# EAGLE design tinyha_hat (EAGLE 7.7.0)
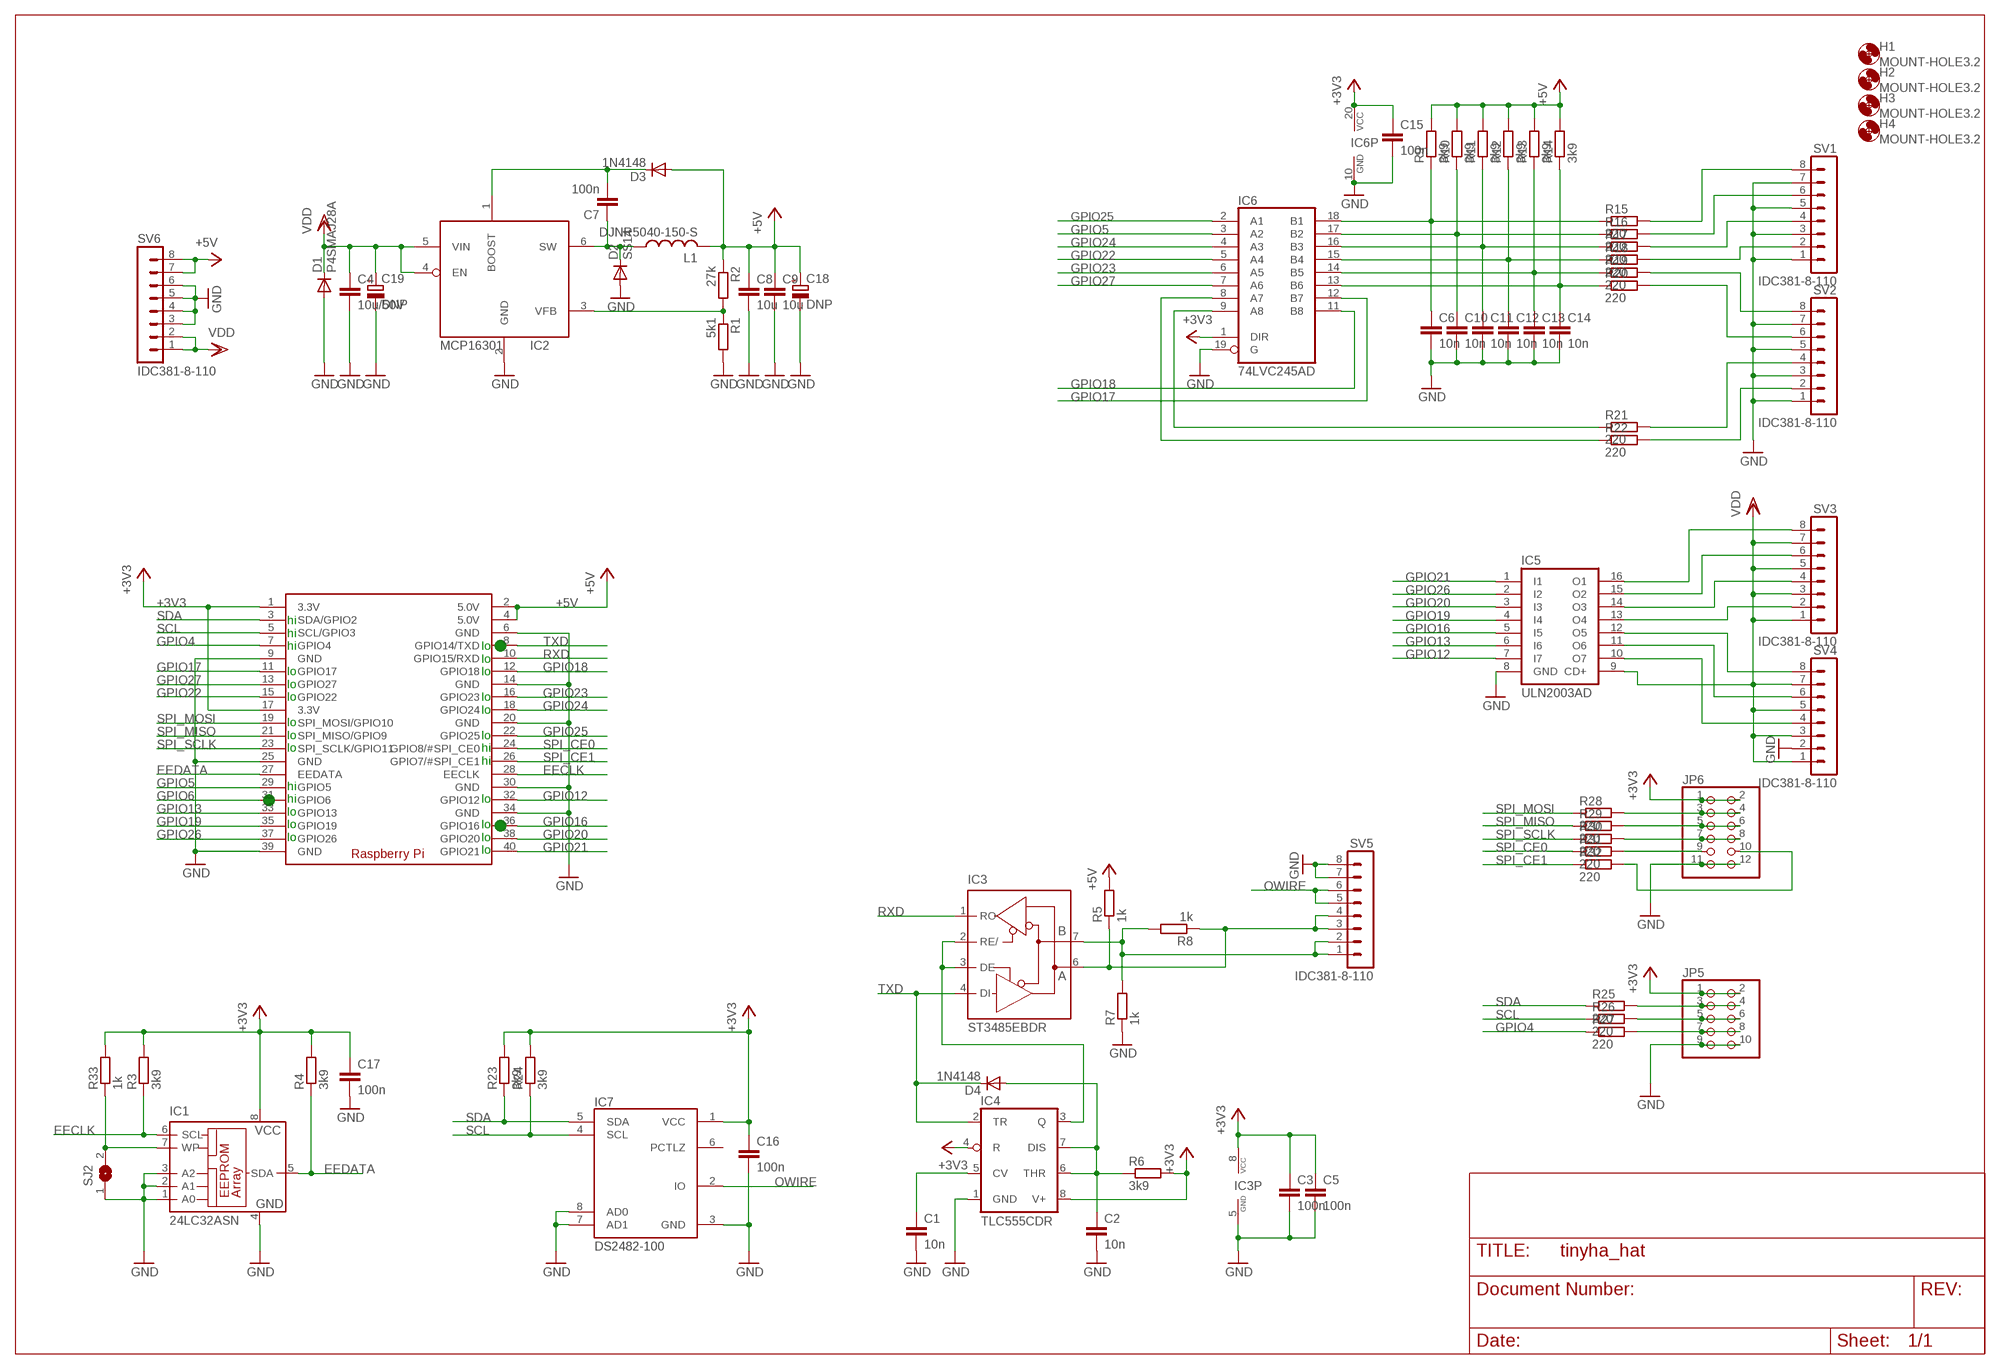
[diagram p0: schematic, sheet 1]

## Parts
C1  10n  C-EUC0603K  [C0603K]
C2  10n  C-EUC0603K  [C0603K]
C3  100n  C-EUC0603K  [C0603K]
C4  10u/50V  C-EUC1210K  [C1210K]
C5  100n  C-EUC0603K  [C0603K]
C6  10n  C-EUC0603K  [C0603K]
C7  100n  C-EUC0603K  [C0603K]
C8  10u  C-EUC0805K  [C0805K]
C9  10u  C-EUC0805K  [C0805K]
C10  10n  C-EUC0603K  [C0603K]
C11  10n  C-EUC0603K  [C0603K]
C12  10n  C-EUC0603K  [C0603K]
C13  10n  C-EUC0603K  [C0603K]
C14  10n  C-EUC0603K  [C0603K]
C15  100n  C-EUC0603K  [C0603K]
C16  100n  C-EUC0603K  [C0603K]
C17  100n  C-EUC0603K  [C0603K]
C18  DNP  CPOL-EUE3.5-8  [E3,5-8]
C19  DNP  CPOL-EUE5-10.5  [E5-10,5]
D1  P4SMAJ28A  DIODE-DO214AC  [DO214AC]
D2  SS14  DIODE-DO214AC  [DO214AC]
D3  1N4148  DIODE-MICROMELF-W  [MICROMELF-W]
D4  1N4148  DIODE-MICROMELF-W  [MICROMELF-W]
H1  MOUNT-HOLE3.2  [3,2]
H2  MOUNT-HOLE3.2  [3,2]
H3  MOUNT-HOLE3.2  [3,2]
H4  MOUNT-HOLE3.2  [3,2]
IC1  24LC32ASN  [SO-08]
IC2  MCP16301  [SOT23-6L]
IC3  ST3485EBDR  MAX481CSA  [SO08]
IC4  TLC555CDR  LM555D  [SO08]
IC5  ULN2003AD  [SO16]
IC6  74LVC245AD  74HC245DW  [SO20W]
IC7  DS2482-100  [SOIC-8]
JP5  PINHD-2X5  [2X05]
JP6  PINHD-2X6  [2X06]
L1  DJNR5040-150-S  DJNR5040  [DJNR5040]
R1  5k1  R-EU_R0603  [R0603]
R2  27k  R-EU_R0603  [R0603]
R3  3k9  R-EU_R0603  [R0603]
R4  3k9  R-EU_R0603  [R0603]
R5  1k  R-EU_R0603  [R0603]
R6  3k9  R-EU_R0603  [R0603]
R7  1k  R-EU_R0603  [R0603]
R8  1k  R-EU_R0603  [R0603]
R9  3k9  R-EU_R0603  [R0603]
R10  3k9  R-EU_R0603  [R0603]
R11  3k9  R-EU_R0603  [R0603]
R12  3k9  R-EU_R0603  [R0603]
R13  3k9  R-EU_R0603  [R0603]
R14  3k9  R-EU_R0603  [R0603]
R15  220  R-EU_R0603  [R0603]
R16  220  R-EU_R0603  [R0603]
R17  220  R-EU_R0603  [R0603]
R18  220  R-EU_R0603  [R0603]
R19  220  R-EU_R0603  [R0603]
R20  220  R-EU_R0603  [R0603]
R21  220  R-EU_R0603  [R0603]
R22  220  R-EU_R0603  [R0603]
R23  3k9  R-EU_R0603  [R0603]
R24  3k9  R-EU_R0603  [R0603]
R25  220  R-EU_R0603  [R0603]
R26  220  R-EU_R0603  [R0603]
R27  220  R-EU_R0603  [R0603]
R28  220  R-EU_R0603  [R0603]
R29  220  R-EU_R0603  [R0603]
R30  220  R-EU_R0603  [R0603]
R31  220  R-EU_R0603  [R0603]
R32  220  R-EU_R0603  [R0603]
R33  1k  R-EU_R0603  [R0603]
RPI1  RASPBERRYPI_BPLUS_ZERO  [PI_HAT_ZERO]
SJ2  SJ  [SJ]
SV1  IDC381-8-110  MA08-1-IDC  [IDC381-8]
SV2  IDC381-8-110  MA08-1-IDC  [IDC381-8]
SV3  IDC381-8-110  MA08-1-IDC  [IDC381-8]
SV4  IDC381-8-110  MA08-1-IDC  [IDC381-8]
SV5  IDC381-8-110  MA08-1-IDC  [IDC381-8]
SV6  IDC381-8-110  MA08-1-IDC  [IDC381-8]

## Nets
+3V3: C3.1 C5.1 C15.1 C16.1 C17.1 IC1.8(VCC) IC3.8(VCC) IC4.4(R) IC4.8(V+) IC6.1(DIR) IC6.20(VCC) IC7.1(VCC) JP5.1 JP5.2 JP6.1 JP6.2 R3.2 R4.2 R6.2 R23.2 R24.2 R33.2 RPI1.1(3.3V) RPI1.17(3.3V)
+5V: C8.1 C9.1 C18.+ D3.A L1.2 R2.1 R5.2 R9.2 R10.2 R11.2 R12.2 R13.2 R14.2 RPI1.2(5.0V) RPI1.4(5.0V) SV6.7 SV6.8
EECLK: IC1.6(SCL) R3.1 RPI1.28(EECLK)
EEDATA: IC1.5(SDA) R4.1 RPI1.27(EEDATA)
GND: C1.2 C2.2 C3.2 C4.2 C5.2 C6.2 C8.2 C9.2 C10.2 C11.2 C12.2 C13.2 C14.2 C15.2 C16.2 C17.2 C18.- C19.- D1.A D2.A IC1.1(A0) IC1.2(A1) IC1.3(A2) IC1.4(GND) IC2.2(GND) IC3.5(GND) IC4.1(GND) IC5.8(GND) IC6.10(GND) IC6.19(G) IC7.3(GND) IC7.7(AD1) IC7.8(AD0) JP5.9 JP5.10 JP6.11 JP6.12 R1.2 R7.1 RPI1.6(GND) RPI1.9(GND) RPI1.14(GND) RPI1.20(GND) RPI1.25(GND) RPI1.30(GND) RPI1.34(GND) RPI1.39(GND) SJ2.1 SV1.1 SV1.3 SV1.5 SV1.7 SV2.1 SV2.3 SV2.5 SV2.7 SV4.2 SV5.7 SV5.8 SV6.3 SV6.4 SV6.5 SV6.6
GPIO4: R27.1 RPI1.7(GPIO4)
GPIO5: IC6.3(A2) RPI1.29(GPIO5)
GPIO6: RPI1.31(GPIO6)
GPIO12: IC5.7(I7) RPI1.32(GPIO12)
GPIO13: IC5.6(I6) RPI1.33(GPIO13)
GPIO16: IC5.5(I5) RPI1.36(GPIO16)
GPIO17: IC6.12(B7) RPI1.11(GPIO17)
GPIO18: IC6.11(B8) RPI1.12(GPIO18)
GPIO19: IC5.4(I4) RPI1.35(GPIO19)
GPIO20: IC5.3(I3) RPI1.38(GPIO20)
GPIO21: IC5.1(I1) RPI1.40(GPIO21)
GPIO22: IC6.5(A4) RPI1.15(GPIO22)
GPIO23: IC6.6(A5) RPI1.16(GPIO23)
GPIO24: IC6.4(A3) RPI1.18(GPIO24)
GPIO25: IC6.2(A1) RPI1.22(GPIO25)
GPIO26: IC5.2(I2) RPI1.37(GPIO26)
GPIO27: IC6.7(A6) RPI1.13(GPIO27)
N$1: C1.1 IC4.5(CV)
N$2: IC5.16(O1) SV3.8
N$3: IC3.2(RE/) IC3.3(DE) IC4.3(Q)
N$4: C2.1 D4.A IC4.6(THR) IC4.7(DIS) R6.1
N$5: IC5.15(O2) SV3.6
N$6: IC5.14(O3) SV3.4
N$7: IC5.13(O4) SV3.2
N$8: IC5.12(O5) SV4.8
N$9: IC5.11(O6) SV4.6
N$10: IC3.7(B) R7.2 R8.2 SV5.1 SV5.2
N$11: IC5.10(O7) SV4.4
N$12: C6.1 IC6.18(B1) R9.1 R15.1
N$13: C10.1 IC6.17(B2) R10.1 R16.1
N$14: IC2.3(VFB) R1.1 R2.2
N$15: C11.1 IC6.16(B3) R11.1 R17.1
N$16: C12.1 IC6.15(B4) R12.1 R18.1
N$17: C13.1 IC6.14(B5) R13.1 R19.1
N$18: C14.1 IC6.13(B6) R14.1 R20.1
N$19: R15.2 SV1.8
N$20: C7.1 D2.C IC2.6(SW) L1.1
N$21: R16.2 SV1.6
N$22: C7.2 D3.C IC2.1(BOOST)
N$24: R17.2 SV1.4
N$25: R18.2 SV1.2
N$26: R19.2 SV2.8
N$27: R20.2 SV2.6
N$28: JP6.3 JP6.4 R28.2
N$29: JP6.5 JP6.6 R29.2
N$30: IC6.9(A8) R21.1
N$31: IC6.8(A7) R22.1
N$32: R21.2 SV2.4
N$33: R22.2 SV2.2
N$34: JP6.7 JP6.8 R30.2
N$35: JP6.9 R31.2
N$36: JP6.10 R32.2
N$37: JP5.3 JP5.4 R25.2
N$38: JP5.5 JP5.6 R26.2
N$39: JP5.7 JP5.8 R27.2
N$40: IC1.7(WP) R33.1 SJ2.2
N$42: IC3.6(A) R5.1 R8.1 SV5.3 SV5.4
OWIRE: IC7.2(IO) SV5.5 SV5.6
RXD: IC3.1(RO) RPI1.10(GPIO15/RXD)
SCL: IC7.4(SCL) R24.1 R26.1 RPI1.5(SCL/GPIO3)
SDA: IC7.5(SDA) R23.1 R25.1 RPI1.3(SDA/GPIO2)
SPI_CE0: R31.1 RPI1.24(GPIO8/#SPI_CE0)
SPI_CE1: R32.1 RPI1.26(GPIO7/#SPI_CE1)
SPI_MISO: R29.1 RPI1.21(SPI_MISO/GPIO9)
SPI_MOSI: R28.1 RPI1.19(SPI_MOSI/GPIO10)
SPI_SCLK: R30.1 RPI1.23(SPI_SCLK/GPIO11)
TXD: D4.C IC3.4(DI) IC4.2(TR) RPI1.8(GPIO14/TXD)
VDD: C4.1 C19.+ D1.C IC2.4(EN) IC2.5(VIN) IC5.9(CD+) SV3.1 SV3.3 SV3.5 SV3.7 SV4.1 SV4.3 SV4.5 SV4.7 SV6.1 SV6.2
Unconnected: IC7.6(PCTLZ)

## Notes on the sheet
- hi
  hi
  hi
  
  lo
  lo
  lo
  
  lo
  lo
  lo
  
  
  hi
  hi
  lo
  lo
  lo
- lo
  lo
  lo
  
  lo
  lo
  
  lo
  hi
  hi
  
  
  lo
  
  lo
  lo
  lo

## Library data of the parts
C1-C17 = rcl:C-EU: CAPACITOR, European symbol
C18 C19 = rcl:CPOL-EU: POLARIZED CAPACITOR, European symbol
D1-D4 = diode:DIODE-: DIODE
H1-H4 = holes:MOUNT-HOLE: MOUNTING HOLE with drill center marker
IC1 = microchip:24*: Serial EEPROM I2C; MF: MICROCHIP; MPN: 24LC32A/SN; OC_FARNELL: 9758003; OC_NEWARK: 33C2976
IC2 = custom:MCP16301
IC3 = maxim:MAX481CSA: RS485 TRANSEIVER; MF: MAXIM; MPN: MAX481CSA; OC_FARNELL: unknown; OC_NEWARK: 90C3817
IC4 = linear:*555: TIMER
IC5 = uln-udn:ULN2003A: DRIVER ARRAY
IC6 = 74xx-eu:74*245: Octal BUS TRANSCEIVER, 3-state
IC7 = dallas-1:DS2482-100
JP5 = pinhead:PINHD-2X5: PIN HEADER
JP6 = pinhead:PINHD-2X6: PIN HEADER
L1 = custom:DJNR5040
R1-R33 = rcl:R-EU_: RESISTOR, European symbol
RPI1 = microbuilder:RASPBERRYPI_BPLUS
SJ2 = jumper:SJ: SMD solder JUMPER
SV1-SV6 = custom:MA08-1: PIN HEADER

## Board
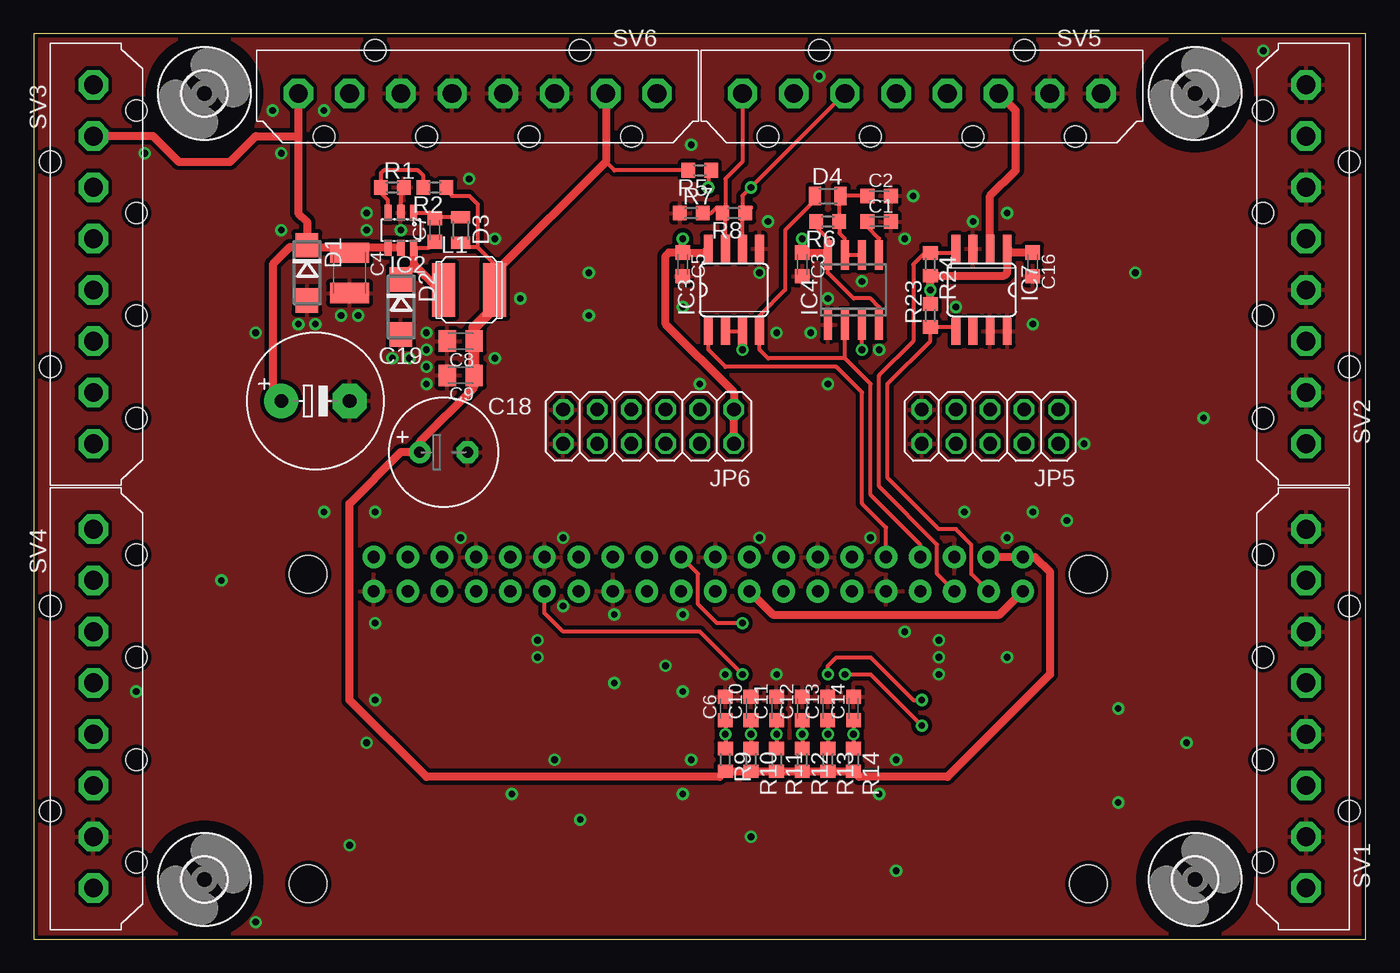
[diagram p1: board, top side]
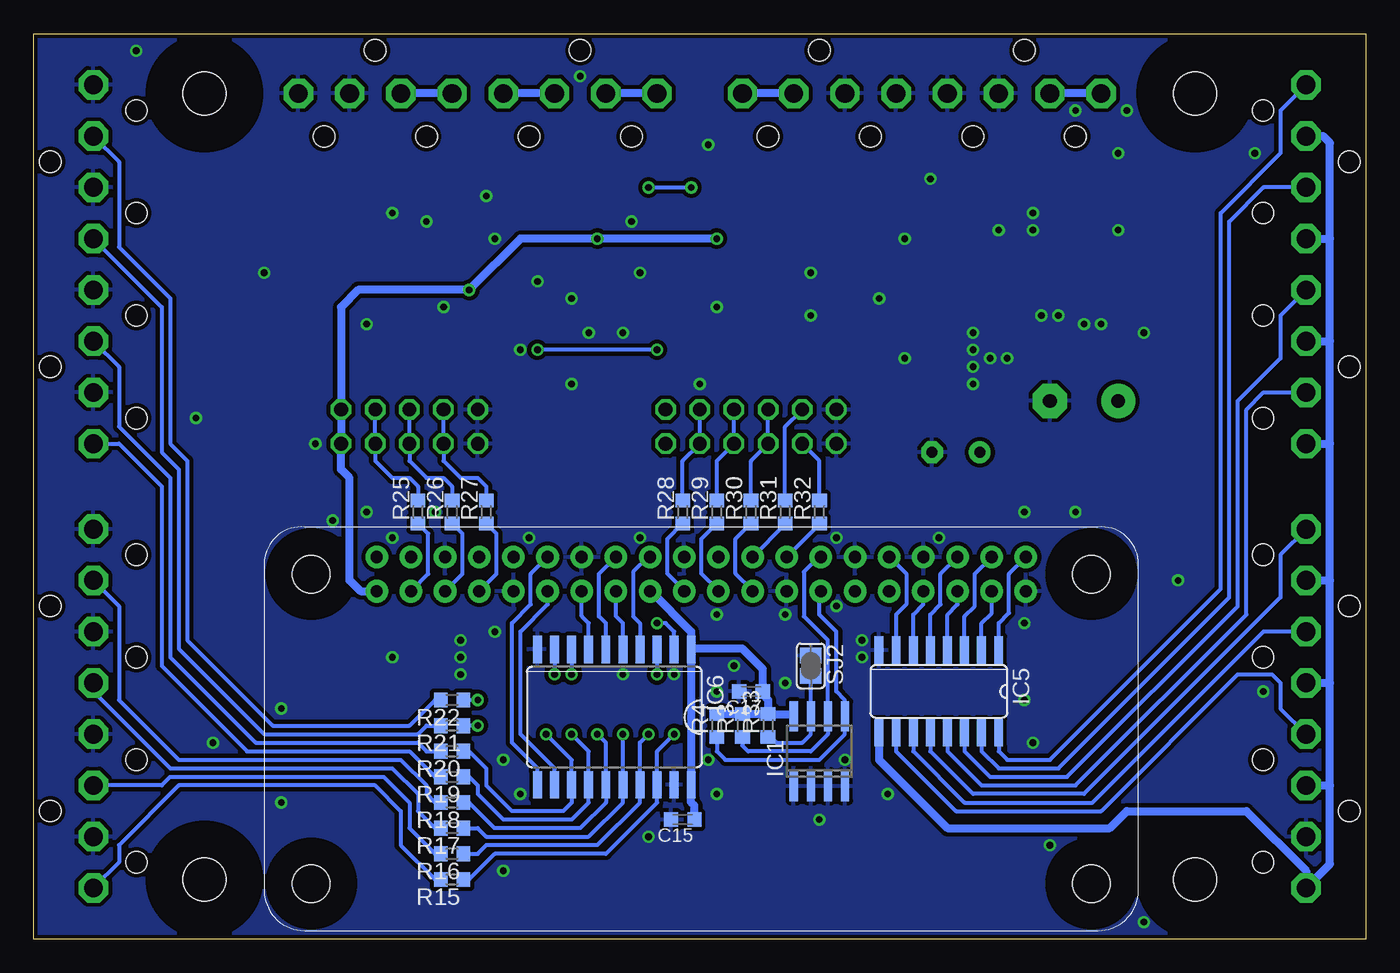
[diagram p2: board, bottom side, seen from below]

Size 99.06 x 67.31 mm. Coordinates in mm from the lower left corner, seen from the top.
Outline: 0,0 99.06,0 99.06,67.31 0,67.31 0,0
Copper layers (1*16): Top 0.035mm / dielectric 1.5mm / Bottom 0.035mm
Design rules "adafruit *": minimum track width 8mil, minimum drill 15.5mil, track to track 8mil, track to pad 8mil, pad to pad 8mil, via to via 8mil, smd to smd 0mil, copper to edge 10mil, drill to drill 8mil, minimum pad ring 10mil, minimum via ring 8mil, stop-mask expansion 2mil, vias tented up to drill 20mil, thermal gap 12mil

### Footprints (pad centres in the part's own frame; a part is rotated, then mirrored left to right if it is on the bottom)
C0603K = smd 1.05 x 1.08: 1 -0.875,0; 2 0.875,0
C1210K = smd 1.5 x 2.9: 1 -1.5,0; 2 1.5,0
C0805K = smd 1.3 x 1.6: 1 -1,0; 2 1,0
E3,5-8 = drill 0.813 pad 1.6: + -1.778,0 | drill 0.813 pad 1.6 octagon: - 1.778,0
E5-10,5 = drill 1.016 pad 2.54: + -2.54,0 | drill 1.016 pad 2.54 octagon: - 2.54,0
DO214AC = smd 1.8 x 1.7: A 2.05,0; C -2.05,0
MICROMELF-W = smd 0.9 x 1.4: A 0.95,0; C -0.95,0
3,2 = hole 3.2: 0,0
SO-08 = smd 0.6 x 2.2: 1 -1.905,-2.6; 2 -0.635,-2.6; 3 0.635,-2.6; 4 1.905,-2.6; 5 1.905,2.6; 6 0.635,2.6; 7 -0.635,2.6; 8 -1.905,2.6
SOT23-6L = smd 0.55 x 1.2: 1 -0.95,-1.3; 2 0,-1.3; 3 0.95,-1.3; 4 0.95,1.3; 5 0,1.3; 6 -0.95,1.3
SO08 = smd 0.66 x 2.032: 1 -1.905,-3.073; 2 -0.635,-3.073; 3 0.635,-3.073; 4 1.905,-3.073; 5 1.905,3.073; 6 0.635,3.073; 7 -0.635,3.073; 8 -1.905,3.073
SO08' = smd 0.6 x 2.2: 1 -1.905,-2.6; 2 -0.635,-2.6; 3 0.635,-2.6; 4 1.905,-2.6; 5 1.905,2.6; 6 0.635,2.6; 7 -0.635,2.6; 8 -1.905,2.6
SO16 = smd 0.66 x 2.032: 1 -4.445,-3.073; 2 -3.175,-3.073; 3 -1.905,-3.073; 4 -0.635,-3.073; 5 0.635,-3.073; 6 1.905,-3.073; 7 3.175,-3.073; 8 4.445,-3.073; 9 4.445,3.073; 10 3.175,3.073; 11 1.905,3.073; 12 0.635,3.073; 13 -0.635,3.073; 14 -1.905,3.073; 15 -3.175,3.073; 16 -4.445,3.073
SO20W = smd 0.66 x 2.032: 1 -5.715,-5.029; 2 -4.445,-5.029; 3 -3.175,-5.029; 4 -1.905,-5.029; 5 -0.635,-5.029; 6 0.635,-5.029; 7 1.905,-5.029; 8 3.175,-5.029; 9 4.445,-5.029; 10 5.715,-5.029; 11 5.715,5.029; 12 4.445,5.029; 13 3.175,5.029; 14 1.905,5.029; 15 0.635,5.029; 16 -0.635,5.029; 17 -1.905,5.029; 18 -3.175,5.029; 19 -4.445,5.029; 20 -5.715,5.029
SOIC-8 = smd 2.032 x 0.66: 1 -3.073,1.27; 2 -3.073,0; 3 -3.073,-1.27; 4 -3.073,-2.54; 5 3.073,-2.54; 6 3.073,-1.27; 7 3.073,0; 8 3.073,1.27
2X05 = drill 1.016 octagon: 1 -5.08,-1.27; 2 -5.08,1.27; 3 -2.54,-1.27; 4 -2.54,1.27; 5 0,-1.27; 6 0,1.27; 7 2.54,-1.27; 8 2.54,1.27; 9 5.08,-1.27; 10 5.08,1.27
2X06 = drill 1.016 octagon: 1 -6.35,-1.27; 2 -6.35,1.27; 3 -3.81,-1.27; 4 -3.81,1.27; 5 -1.27,-1.27; 6 -1.27,1.27; 7 1.27,-1.27; 8 1.27,1.27; 9 3.81,-1.27; 10 3.81,1.27; 11 6.35,-1.27; 12 6.35,1.27
DJNR5040 = smd 1.7 x 4: 1 -1.9,0; 2 1.9,0
R0603 = smd 1 x 1.1: 1 -0.85,0; 2 0.85,0
PI_HAT_ZERO = drill 0.9 pad 1.676: 1 8.37,25.23; 2 8.37,27.77; 3 10.91,25.23; 4 10.91,27.77; 5 13.45,25.23; 6 13.45,27.77; 7 15.99,25.23; 8 15.99,27.77; 9 18.53,25.23; 10 18.53,27.77; 11 21.07,25.23; 12 21.07,27.77; 13 23.61,25.23; 14 23.61,27.77; 15 26.15,25.23; 16 26.15,27.77; 17 28.69,25.23; 18 28.69,27.77; 19 31.23,25.23; 20 31.23,27.77; 21 33.77,25.23; 22 33.77,27.77; 23 36.31,25.23; 24 36.31,27.77; 25 38.85,25.23; 26 38.85,27.77; 27 41.39,25.23; 28 41.39,27.77; 29 43.93,25.23; 30 43.93,27.77; 31 46.47,25.23; 32 46.47,27.77; 33 49.01,25.23; 34 49.01,27.77; 35 51.55,25.23; 36 51.55,27.77; 37 54.09,25.23; 38 54.09,27.77; 39 56.63,25.23; 40 56.63,27.77 | hole 2.8: 3.5,3.5; 3.5,26.5; 61.5,26.5; 61.5,3.5
SJ = smd 1.168 x 1.6: 1 -0.762,0; 2 0.762,0
IDC381-8 = drill 1.4 pad 2.184 octagon: 1 -13.335,0; 2 -9.525,0; 3 -5.715,0; 4 -1.905,0; 5 1.905,0; 6 5.715,0; 7 9.525,0; 8 13.335,0 | hole 1.6: -11.43,-3.2; -3.81,-3.2; 3.81,-3.2; 11.43,-3.2; -7.62,3.2; 7.62,3.2

### Placement (x,y rotation side)
C1  62.87,53.34 0 top
C2  62.87,55.24 0 top
C3  57.15,50.16 270 top
C4  23.5,49.53 270 top
C5  48.26,50.16 270 top
C6  51.44,17.14 90 top
C7  29.84,52.7 90 top
C8  31.75,44.45 180 top
C9  31.75,41.91 180 top
C10  53.34,17.14 90 top
C11  55.24,17.14 90 top
C12  57.15,17.14 90 top
C13  59.05,17.14 90 top
C14  60.96,17.14 90 top
C15  50.8,8.89 180 bottom
C16  74.3,50.16 270 top
C17  45.72,18.41 180 bottom
C18  30.48,36.2 0 top
C19  20.95,40.01 0 top
D1  20.32,49.53 270 top
D2  27.3,46.99 270 top
D3  31.75,52.7 270 top
D4  59.05,55.24 0 top
H1  12.7,4.45 0 top
H2  86.36,4.45 0 top
H3  12.7,62.87 0 top
H4  86.36,62.87 0 top
IC1  40.64,13.97 0 bottom
IC2  27.3,52.7 180 top
IC3  52.07,48.26 0 top
IC4  TLC555CDR  [SO08']  60.96,48.26 0 top
IC5  31.75,18.41 180 bottom
IC6  55.88,16.51 180 bottom
IC7  71.12,48.26 270 top
JP5  71.12,38.1 180 top
JP6  45.72,38.1 180 top
L1  32.38,48.26 0 top
R1  26.67,55.88 0 top
R2  29.84,55.88 180 top
R3  46.35,15.88 90 bottom
R4  48.26,15.88 90 bottom
R5  49.53,57.15 180 top
R6  59.05,53.34 180 top
R7  48.9,53.98 0 top
R8  52.07,53.98 180 top
R9  51.44,13.34 270 top
R10  53.34,13.34 270 top
R11  55.24,13.34 270 top
R12  57.15,13.34 270 top
R13  59.05,13.34 270 top
R14  60.96,13.34 270 top
R15  67.94,4.45 180 bottom
R16  67.94,6.35 180 bottom
R17  67.94,8.26 180 bottom
R18  67.94,10.16 180 bottom
R19  67.94,12.06 180 bottom
R20  67.94,13.97 180 bottom
R21  67.94,15.88 180 bottom
R22  67.94,17.78 180 bottom
R23  66.67,46.35 90 top
R24  66.67,50.16 270 top
R25  70.48,31.75 90 bottom
R26  67.94,31.75 90 bottom
R27  65.41,31.75 90 bottom
R28  50.8,31.75 90 bottom
R29  48.26,31.75 90 bottom
R30  45.72,31.75 90 bottom
R31  43.18,31.75 90 bottom
R32  40.64,31.75 90 bottom
R33  44.45,15.88 90 bottom
RPI1  81.92,0.64 0 bottom
SJ2  41.27,20.32 270 bottom
SV1  94.61,17.14 270 top
SV2  94.61,50.16 270 top
SV3  4.45,50.16 90 top
SV4  4.45,17.14 90 top
SV5  66.04,62.87 0 top
SV6  33.02,62.87 0 top

### Tracks (layer width: path | path; a pad name or v marks a point on that pad's centre or on a via)
+3V3  (via drill 0.5)
  Top 0.305: R6.2 58.2,52.92 59.05,52.07 IC4.8 59.05,49.53 60.96,47.62 62.23,47.62 62.87,46.99 IC4.4
  Top 0.61: C16.1 72.68,51.04 IC7.1 72.39,49.53 72.17,49.31 R24.2 v66.67,48.26 R23.2 | IC4.8 58.88,51.04 C3.1 v57.15,52.07 | C5.1 49.87,51.04 IC3.8 | C5.1 47.23,51.04 46.99,50.8 46.99,45.72 52.07,40.64 JP6.1 JP6.2 | C5.1 v48.26,52.07 | RPI1.1 71.81,24.13 54.96,24.13 RPI1.17
  Bottom 0.61: v48.26,52.07 v57.15,52.07 62.87,52.07 v66.67,48.26 74.93,48.26 76.2,46.99 JP5.1 JP5.2 76.2,34.92 75.56,34.29 75.56,26.67 74.76,25.86 RPI1.1 | IC6.1 50.16,22.86 53.17,25.86 RPI1.17 | IC6.1 IC6.20 50.16,10.16 49.92,9.92 C15.1 | IC6.1 50.11,21.59 46.35,21.59 44.84,20.08 C17.1 44.84,18.18 44.45,17.78 R33.2 | R33.2 42.7,16.73 IC1.8 | R33.2 R3.2 R4.2
+5V
  Top 0.305: R2.1 30.7,55.66 31.11,55.24 32.38,55.24 33.02,54.61 33.02,51.44 | 33.02,51.44 34.29,50.16 L1.2 | 33.02,51.44 32.07,51.44 D3.A | R5.2 43.18,57.15 42.55,57.78
  Top 0.61: 34.29,49.53 42.55,57.78 SV6.7 | C9.1 32.75,41.01 28.7,36.96 C18.+ 27.3,36.2 23.5,32.38 23.5,17.78 29.21,12.06 51.02,12.06 R9.2 R10.2 R11.2 R12.2 R13.2 R14.2 61.38,12.06 67.94,12.06 75.56,19.68 75.56,27.3 74.47,28.41 RPI1.2 RPI1.4
  Top 0.813: C9.1 C8.1 32.75,45.45 34.28,46.98 L1.2 34.29,49.53
  Bottom 0.61: SV6.7 SV6.8
EECLK
  Bottom 0.305: RPI1.28 40.68,28.41 41.78,27.3 41.78,24 40.01,22.23 IC1.6 40.01,15.24 41.27,13.97 45.94,13.97 46.35,14.39 R3.1
EEDATA
  Bottom 0.305: R4.1 48.26,13.97 47.62,13.34 40.64,13.34 38.73,15.24 IC1.5 38.73,17.78 39.37,18.41 39.37,22.86 40.64,24.13 40.64,25.75 RPI1.27
GND  (via drill 0.5)
  Top 0.305: R1.2 27.52,55.46 27.3,55.24 IC2.2
  other vias: 27.3,52.7 53.98,49.53 54.61,53.34 64.77,22.86 55.24,19.68 51.44,19.68 62.87,10.79 64.14,13.34 67.31,20.95 67.31,22.23 67.31,19.68 72.39,20.95 80.64,17.14 80.64,10.16 64.14,5.08 53.34,7.62 48.9,13.34 38.73,13.34 40.64,8.89 35.56,10.79 37.47,22.23 37.47,20.95 39.37,24.77 43.18,24.13 48.26,24.13 25.4,23.5 25.4,17.78 24.77,14.61 23.5,6.99 13.97,26.67 19.68,45.72 20.95,45.72 22.86,46.35 24.13,46.35 26.67,43.18 27.94,43.18 29.21,45.09 29.21,43.81 29.21,42.55 29.21,41.27 34.29,43.18 31.75,29.84 39.37,29.84 53.98,29.84 62.23,29.84 62.87,43.81 57.78,45.09 55.24,45.09 59.05,47.62 61.59,48.9 64.77,52.07 74.3,31.75 72.39,29.84 74.3,45.72 68.58,46.99 69.85,53.34 65.41,55.24 81.92,49.53 41.27,49.53 41.27,46.35 24.77,52.7 24.77,53.98 32.38,56.52 34.29,52.07 36.2,47.62 69.22,31.75 43.18,19.05 46.99,20.32 48.26,18.41 48.26,10.79 16.51,1.27 7.62,18.41 8.26,58.42 18.41,58.42 18.41,52.7 16.51,45.09 25.4,31.75 21.59,31.75 85.72,14.61 87,38.73 91.44,66.04 78.11,36.83 59.05,41.27 49.53,41.27 48.26,46.99 72.39,53.98 58.42,64.14 48.9,59.05 21.59,61.59 17.78,61.59 76.83,31.11
  pour Top (isolate 0.305): 0,0 99.06,0 99.06,67.31 0,67.31
  pour Bottom (isolate 0.305): 0,0 99.06,0 99.06,67.31 0,67.31
GPIO4
  Bottom 0.305: RPI1.7 64.64,27.15 64.64,30.14 R27.1
GPIO5  (via drill 0.5)
  Top 0.305: RPI1.29 37.98,24.25 39.37,22.86 49.53,22.86 v52.7,19.68
  Bottom 0.305: IC6.3 v52.7,19.68
GPIO12
  Bottom 0.305: IC5.7 34.92,24.13 34.16,24.89 34.16,27.18 35.39,28.41 RPI1.32
GPIO13
  Bottom 0.305: IC5.6 33.66,24.13 32.91,24.88 RPI1.33
GPIO16
  Bottom 0.305: IC5.5 32.38,24.13 31.62,24.89 31.62,27.15 RPI1.36
GPIO17
  Bottom 0.305: IC6.12 60.33,12.7 62.87,15.24 62.87,22.86 60.84,24.88 RPI1.11
GPIO18
  Bottom 0.305: IC6.11 61.59,12.7 63.5,14.61 63.5,23.5 62.1,24.89 62.1,27.15 RPI1.12
GPIO19
  Bottom 0.305: IC5.4 31.11,24.13 30.36,24.88 RPI1.35
GPIO20
  Bottom 0.305: IC5.3 29.84,24 29.08,24.77 29.08,27.15 RPI1.38
GPIO21
  Bottom 0.305: IC5.1 27.3,23.5 26.54,24.26 26.54,27.15 RPI1.40
GPIO22
  Bottom 0.305: IC6.5 55.24,23.5 55.77,24.02 RPI1.15
GPIO23
  Bottom 0.305: IC6.6 56.52,23.5 57.02,24 57.02,27.15 RPI1.16
GPIO24
  Bottom 0.305: IC6.4 53.98,23.5 54.48,24 54.48,27.3 53.38,28.41 RPI1.18
GPIO25  (via drill 0.5)
  Top 0.305: v52.7,23.5 50.8,23.5 49.4,24.89 49.4,27.15 RPI1.22
  Bottom 0.305: IC6.2 51.44,22.86 52.07,23.5 v52.7,23.5
GPIO26
  Bottom 0.305: IC5.2 28.57,23.5 27.82,24.25 RPI1.37
GPIO27
  Bottom 0.305: IC6.7 57.78,23.5 58.3,24.02 RPI1.13
N$1
  Top 0.305: IC4.5 62.87,52.07 61.99,52.95 C1.1
N$2
  Bottom 0.305: IC5.16 27.3,13.97 26.67,13.34 23.5,13.34 10.79,26.04 10.79,53.98 6.35,58.42 6.35,61.59 SV3.8
N$3  (via drill 0.5)
  Top 0.305: IC3.2 IC3.3 v52.7,43.81 | v61.59,43.81 IC4.3
  Bottom 0.305: v52.7,43.81 v61.59,43.81
N$4
  Top 0.305: C2.1 D4.A 59.91,55.15 R6.1 59.91,52.49 60.33,52.07 IC4.7 IC4.6
N$5
  Bottom 0.305: IC5.15 28.57,13.97 27.3,12.7 22.86,12.7 10.16,25.4 10.16,53.34 7.62,55.88 SV3.6
N$6
  Bottom 0.305: IC5.14 29.84,13.97 27.94,12.06 22.23,12.06 9.53,24.77 9.53,40.01 6.35,43.18 6.35,46.35 SV3.4
N$7
  Bottom 0.305: IC5.13 31.11,13.97 28.57,11.43 21.59,11.43 8.89,24.13 8.89,39.37 7.62,40.64 SV3.2
N$8
  Bottom 0.305: IC5.12 32.38,13.97 29.21,10.79 20.95,10.79 6.35,25.4 6.35,28.57 SV4.8
N$9
  Bottom 0.305: IC5.11 33.66,13.97 29.84,10.16 20.32,10.16 7.62,22.86 SV4.6
N$10
  Top 0.305: IC3.7 51.44,53.76 R8.2 | R8.2 50.8,54.4 50.38,53.98 R7.2 | SV5.1 52.7,57.78 51.44,56.52 51.44,54.19 R8.2
  Bottom 0.61: SV5.1 SV5.2
N$11
  Bottom 0.305: IC5.10 34.92,13.97 30.48,9.53 19.68,9.53 9.53,19.68 6.99,19.68 6.35,19.05 6.35,17.14 SV4.4
N$12  (via drill 0.5)
  Top 0.305: C6.1 v51.44,15.24 R9.1
  Bottom 0.305: v51.44,15.24 52.7,13.97 IC6.18 52.7,10.16 56.52,6.35 64.77,6.35 66.67,4.45 R15.1
N$13  (via drill 0.5)
  Top 0.305: C10.1 v53.34,15.24 R10.1
  Bottom 0.305: v53.34,15.24 53.98,14.61 IC6.17 53.98,10.16 57.15,6.99 65.41,6.99 66.04,6.35 R16.1
N$14
  Top 0.305: IC2.3 26.36,54.92 25.82,55.46 R1.1 25.82,56.94 26.04,57.15 28.57,57.15 29,56.73 R2.2
N$15  (via drill 0.5)
  Top 0.305: C11.1 v55.24,15.24 R11.1
  Bottom 0.305: v55.24,15.24 IC6.16 55.24,10.16 57.78,7.62 65.41,7.62 66.04,8.26 R17.1
N$16  (via drill 0.5)
  Top 0.305: C12.1 v57.15,15.24 R12.1
  Bottom 0.305: v57.15,15.24 56.52,14.61 IC6.15 56.52,10.16 58.42,8.26 64.77,8.26 66.67,10.16 R18.1
N$17  (via drill 0.5)
  Top 0.305: C13.1 v59.05,15.24 R13.1
  Bottom 0.305: v59.05,15.24 57.78,13.97 IC6.14 57.78,10.16 59.05,8.89 64.14,8.89 66.04,10.79 66.04,11.43 66.67,12.06 R19.1
N$18  (via drill 0.5)
  Top 0.305: C14.1 v60.96,15.24 R14.1
  Bottom 0.305: v60.96,15.24 59.05,13.34 IC6.13 59.05,10.16 59.69,9.53 63.5,9.53 65.41,11.43 65.41,12.7 66.67,13.97 R20.1
N$19
  Bottom 0.305: R15.2 69.22,4.45 71.75,6.99 71.75,9.53 73.66,11.43 88.27,11.43 92.71,6.99 92.71,5.71 SV1.8
N$20
  Top 0.305: IC2.6 29.42,51.41 C7.1
  Top 0.61: IC2.6 28.25,50.16 | 28.25,50.16 28.25,49.99 D2.C | L1.1 30.16,48.26 28.25,50.16
N$21
  Bottom 0.305: R16.2 69.22,6.35 71.12,8.26 71.12,10.16 73.03,12.06 88.9,12.06 89.53,11.43 SV1.6
N$22
  Top 0.305: IC2.1 29.42,54.01 C7.2 29.92,53.66 D3.C
N$24
  Bottom 0.305: R17.2 69.22,8.26 70.48,9.53 70.48,10.79 72.39,12.7 88.9,12.7 94.61,18.41 SV1.4
N$25
  Bottom 0.305: R18.2 69.22,10.16 69.85,10.79 69.85,11.43 71.75,13.34 88.27,13.34 92.71,17.78 92.71,24.77 SV1.2
N$26
  Bottom 0.305: R19.2 69.22,12.06 71.12,13.97 83.19,13.97 89.53,20.32 89.53,33.66 92.71,36.83 SV2.8
N$27
  Bottom 0.305: R20.2 69.85,13.97 70.48,14.61 82.55,14.61 88.9,20.95 88.9,34.29 92.71,38.1 92.71,42.55 SV2.6
N$28
  Bottom 0.305: JP6.3 JP6.4 50.8,35.56 R28.2
N$29
  Bottom 0.305: JP6.5 JP6.6 48.26,35.56 R29.2
N$30  (via drill 0.5)
  Top 0.305: v60.33,19.68 62.23,19.68 v66.04,15.88
  Bottom 0.305: IC6.9 v60.33,19.68 | v66.04,15.88 R21.1
N$31  (via drill 0.5)
  Top 0.305: v59.05,19.68 59.05,20.32 59.69,20.95 62.23,20.95 65.41,17.78 v66.04,17.78
  Bottom 0.305: IC6.8 v59.05,19.68 | v66.04,17.78 R22.1
N$32
  Bottom 0.305: R21.2 69.85,15.88 70.48,15.24 81.92,15.24 88.27,21.59 88.27,34.92 89.53,36.2 89.53,46.99 SV2.4
N$33
  Bottom 0.305: R22.2 69.22,17.78 71.12,15.88 81.28,15.88 87.63,22.23 87.63,35.56 88.9,36.83 88.9,47.62 92.71,51.44 92.71,57.78 SV2.2
N$34
  Bottom 0.305: JP6.7 JP6.8 45.72,35.56 R30.2
N$35
  Bottom 0.305: JP6.9 43.18,38.1 R31.2
N$36
  Bottom 0.305: R32.2 40.64,35.56 JP6.10
N$37
  Bottom 0.305: JP5.3 JP5.4 73.66,35.56 72.39,34.29 71.12,34.29 70.48,33.66 R25.2
N$38
  Bottom 0.305: JP5.5 JP5.6 71.12,35.56 69.85,34.29 68.58,34.29 67.94,33.66 R26.2
N$39
  Bottom 0.305: JP5.7 JP5.8 68.58,35.56 67.31,34.29 66.04,34.29 65.41,33.66 R27.2
N$40
  Bottom 0.305: R33.1 44.23,15.03 43.81,14.61 41.91,14.61 41.27,15.24 IC1.7 SJ2.2
N$42  (via drill 0.5)
  Top 0.305: 53.34,54.4 R8.1 | IC3.6 52.7,53.76 R8.1 | SV5.3 v53.34,55.88 52.7,55.24 52.7,54.19 R8.1 | R5.1 50.16,57.15 v50.16,55.88
  Bottom 0.305: v53.34,55.88 v50.16,55.88
  Bottom 0.61: SV5.3 SV5.4
OWIRE
  Top 0.61: IC7.2 71.12,55.24 73.03,57.15 73.03,61.59 SV5.6
  Bottom 0.61: SV5.5 SV5.6
RXD
  Top 0.305: IC3.1 50.16,43.81 51.44,42.55 59.69,42.55 61.59,40.64 61.59,32.38 63.38,30.59 RPI1.10
SCL
  Top 0.305: IC7.4 68.26,51.02 R24.1 66.25,51.02 65.41,50.16 65.41,44.45 62.87,41.91 62.87,33.66 67.18,29.34 67.18,27.15 RPI1.5
  Bottom 0.305: RPI1.5 67.18,27.15 67.18,30.14 R26.1
SDA
  Top 0.305: IC7.5 68.26,45.51 R23.1 66.67,44.45 63.5,41.27 63.5,34.29 67.31,30.48 68.58,30.48 69.72,29.34 69.72,27.15 RPI1.3
  Bottom 0.305: RPI1.3 69.72,27.15 69.72,30.14 R25.1
SPI_CE0
  Bottom 0.305: R31.1 43.18,30.83 RPI1.24
SPI_CE1
  Bottom 0.305: R32.1 40.64,30.83 RPI1.26
SPI_MISO
  Bottom 0.305: R29.1 49.4,29.76 49.4,27.18 48.15,25.92 RPI1.21
SPI_MOSI
  Bottom 0.305: R28.1 51.94,29.76 51.94,27.18 50.69,25.92 RPI1.19
SPI_SCLK
  Bottom 0.305: R30.1 46.86,29.76 46.86,27.18 45.6,25.92 RPI1.23
TXD
  Top 0.305: D4.C 58.1,54.93 55.88,52.7 55.88,48.26 53.98,46.35 IC3.4 53.98,43.81 54.61,43.18 60.33,43.18 | 60.33,43.18 IC4.2 | RPI1.8 65.92,29.32 62.23,33.02 62.23,41.27 60.33,43.18
VDD
  Top 0.61: IC2.5 IC2.4 23.87,51.41 C4.1 23.09,51.44 20.32,51.44 | 20.32,51.44 D1.C 20.32,53.34 19.68,53.98 19.68,59.69 | SV6.1 19.68,59.69 | SV3.7 8.89,59.69 10.79,57.78 14.61,57.78 16.51,59.69 19.68,59.69 | 20.32,51.44 19.05,51.44 17.78,50.16 17.78,40.64 C19.+
  Bottom 0.61: IC5.9 36.2,13.34 31.11,8.26 19.05,8.26 17.78,9.53 8.89,9.53 4.45,5.08 SV4.1 2.67,5.59 2.67,11.43 | SV6.1 SV6.2 | 2.67,11.43 2.67,19.05 | 2.67,19.05 2.67,26.67 | 2.67,26.67 2.67,36.83 | 2.67,36.83 2.67,44.45 | 2.67,44.45 2.67,52.07 | 2.67,52.07 2.67,59.18 3.17,59.69 SV3.7 | SV3.5 2.67,52.07 | SV3.3 2.67,44.45 | SV3.1 2.67,36.83 | SV4.7 2.67,26.67 | SV4.5 2.67,19.05 | SV4.3 2.67,11.43

### Text on the board
potisk: X1 | G | 21 | +24V | +24V | G | G | G | G | +5V | +5V | B | B | A | A | 1W | 1W | G | G | 17 | + | O2 | 26 | X2 | G | +24V | O1 | 18 | 20 | X3 | G | +24V | I6 | 27 | 19 | SPI | I2C | X4 | G | +24V | I5 | 23 | Raspberry Pi Zero @ TinyHA | 16 | X5 | G | +24V | I4 | 22 | 13 | X6 | G | +24V | I3 | 24 | 12 | X7 | G | +24V | I2 | 05 | G | G | TinyHA-HAT-v1 | alpov 2018 | 25 | + | I1